# EAGLE board aleph-121205 (EAGLE 5.11), part 1 of 3
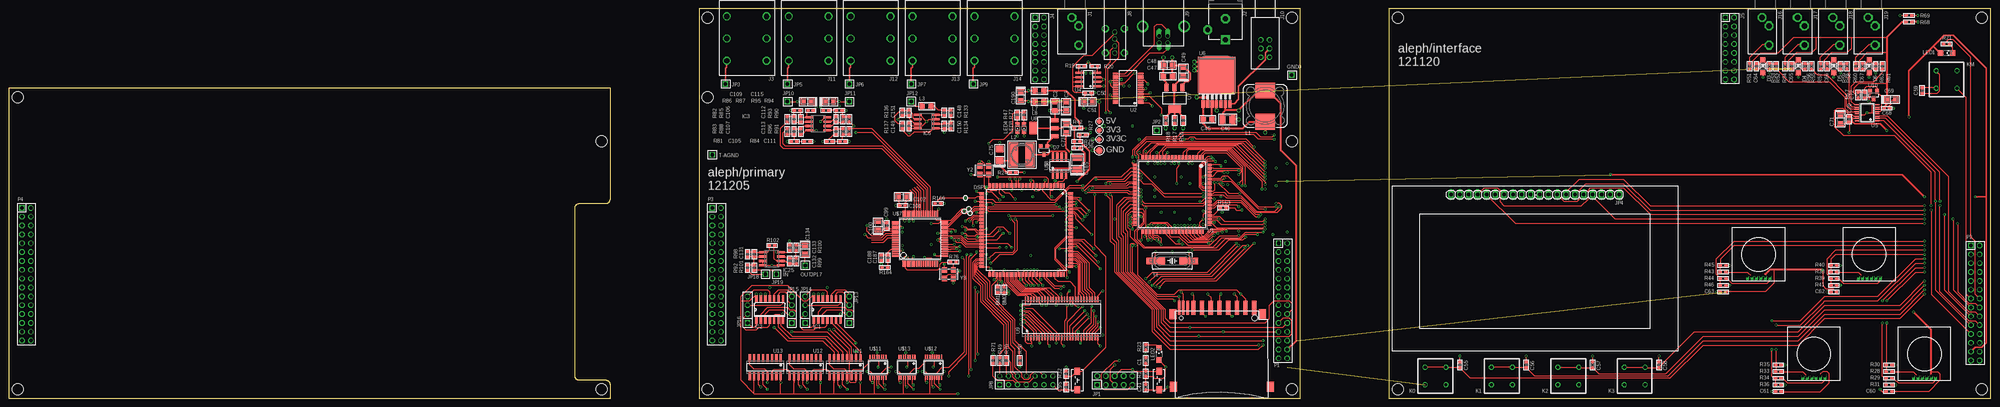
[diagram p8: board, top side]
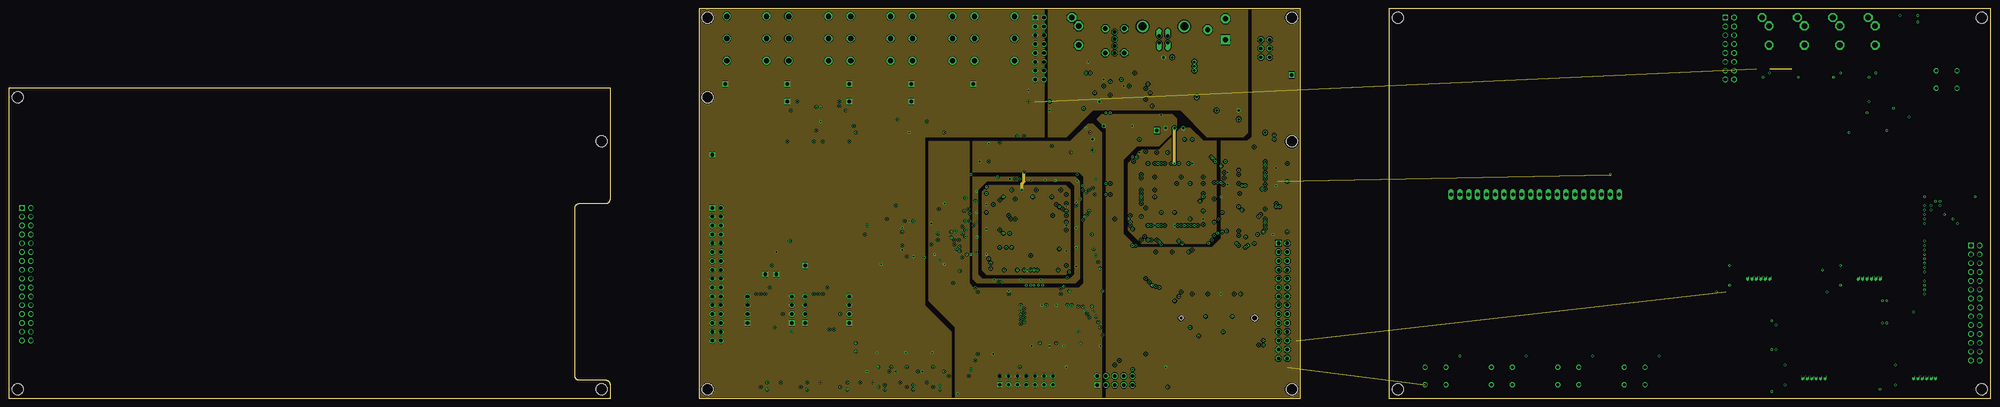
[diagram p9: board, inner layer Route2]
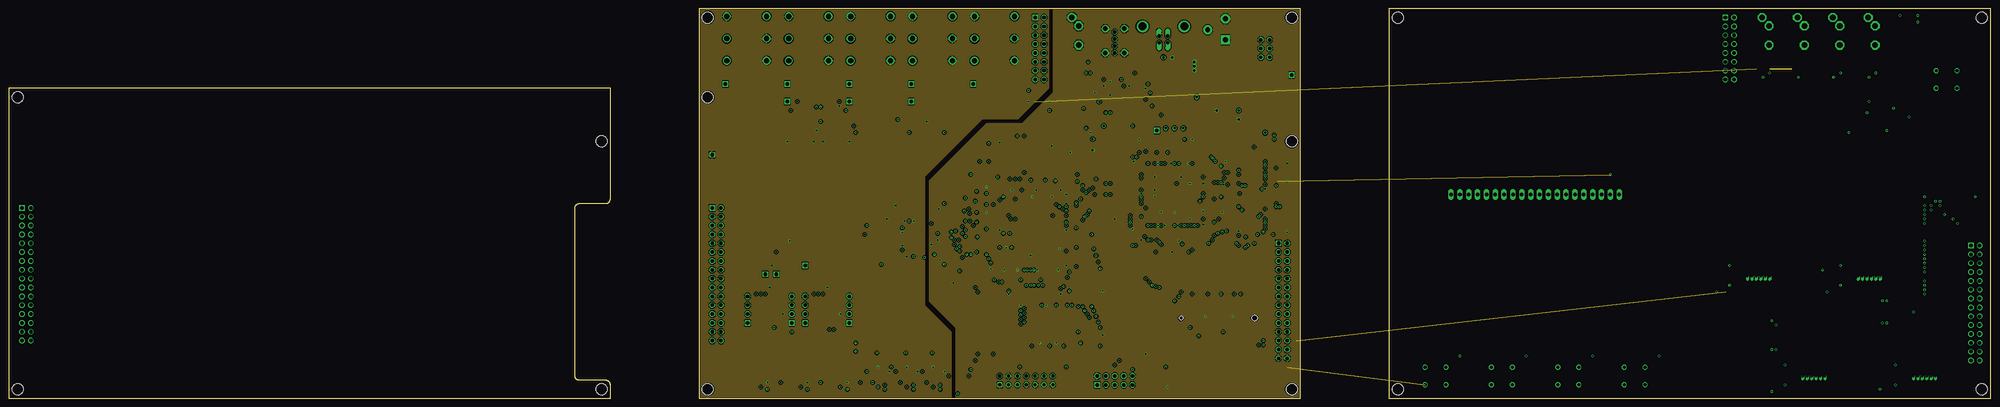
[diagram p10: board, inner layer Route3]
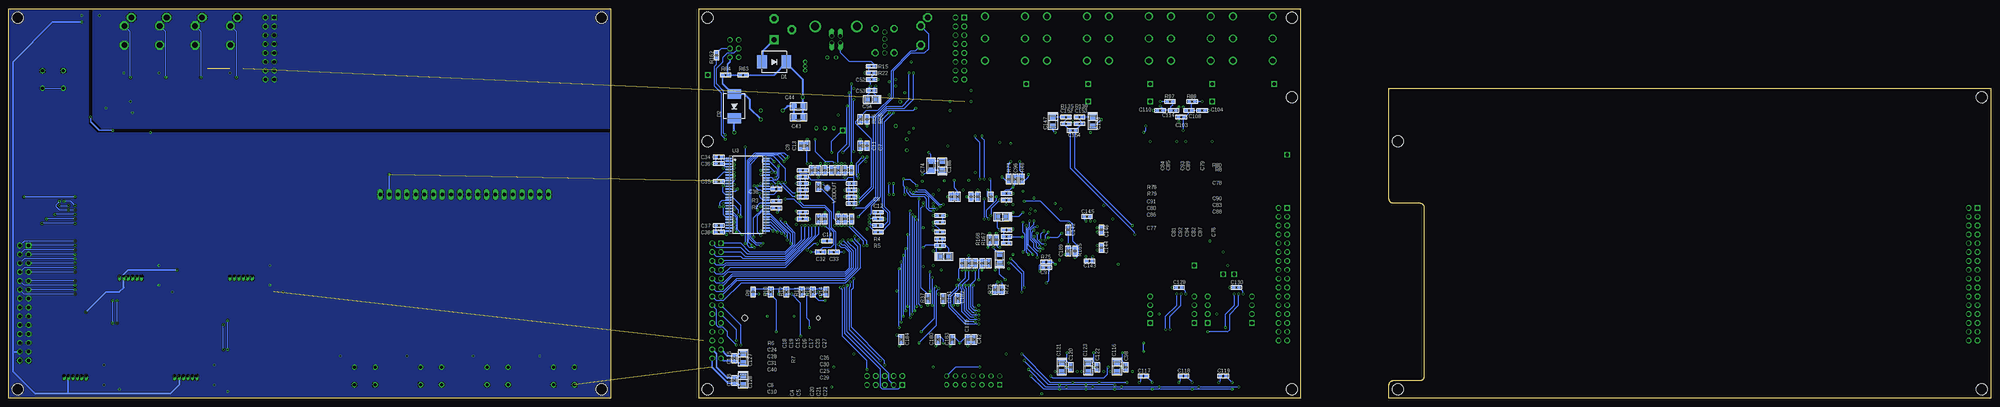
[diagram p11: board, bottom side, seen from below]

Size 568.96 x 111.76 mm. Coordinates in mm from the lower left corner, seen from the top.
Outline: 198.12,0 370.84,0 370.84,111.76 198.12,111.76 198.12,0
Outline: 396.24,0 568.96,0 568.96,111.76 396.24,111.76 396.24,0
Outline: 172.72,0 172.72,3.81 arc90 171.45,5.08 163.83,5.08 arc-90 162.56,6.35 162.56,54.61 arc-90 163.83,55.88 171.45,55.88 arc90 172.72,57.15 172.72,88.9 0,88.9 0,0 172.72,0
Copper layers (1*2+3*16): Top 0.035mm / dielectric 1.5mm / Route2 0.035mm / dielectric 0.15mm / Route3 0.035mm / dielectric 0.2mm / Bottom 0.035mm
Design rules "default *": minimum track width 6mil, minimum drill 15mil, track to track 6mil, track to pad 6mil, pad to pad 6mil, via to via 6mil, smd to smd 6mil, copper to edge 10mil, drill to drill 8mil, minimum pad ring 6mil, minimum via ring 6mil, stop-mask expansion 4mil, vias tented up to drill 0mil, thermal gap 10mil
Holes 3.2 mm at 368.3,109.22 200.66,109.22 200.66,2.54 368.3,2.54 170.18,2.54 170.18,73.66 2.54,86.36 2.54,2.54 200.66,86.36 368.3,73.66 398.78,2.54 398.78,109.22 566.42,109.22 566.42,2.54

## Footprints (pad centres in the part's own frame; a part is rotated, then mirrored left to right if it is on the bottom)
SMD-15R = smd 1.5 x 1.5: TP 0,0
R0603 = smd 0.9 x 0.8: 1 -0.762,0; 2 0.762,0
C0603 = smd 0.9 x 0.8: 1 -0.762,0; 2 0.762,0
C1206 = smd 1.4 x 1.8: 1 -1.27,0; 2 1.27,0
C1206/T = smd 1.4 x 1.9: + 1.27,0; - -1.27,0
C3225 = smd 1.6 x 2.7: 1 -1.397,0; 2 1.397,0
C3528/T = smd 2 x 2.2: + 1.651,0; - -1.651,0
C1210/T = smd 1.6 x 3: + 1.651,0; - -1.651,0
SMC = smd 2.8 x 3.8: A 3.493,0; C -3.493,0
SOD123 = smd 1.4 x 1.4: A 1.905,0; C -1.905,0
SOT23 = smd 1 x 1.4: 1 -0.95,-1.1; 2 0.95,-1.1; 3 0,1.1
LQFP176 = smd 1.5 x 0.25: P$1 -12.8,10.75; P$2 -12.8,10.25; P$3 -12.8,9.75; P$4 -12.8,9.25; P$5 -12.8,8.75; P$6 -12.8,8.25; P$7 -12.8,7.75; P$8 -12.8,7.25; P$9 -12.8,6.75; P$10 -12.8,6.25; P$11 -12.8,5.75; P$12 -12.8,5.25; P$13 -12.8,4.75; P$14 -12.8,4.25; P$15 -12.8,3.75; P$16 -12.8,3.25; P$17 -12.8,2.75; P$18 -12.8,2.25; P$19 -12.8,1.75; P$20 -12.8,1.25; P$21 -12.8,0.75; P$22 -12.8,0.25; P$23 -12.8,-0.25; P$24 -12.8,-0.75; P$25 -12.8,-1.25; P$26 -12.8,-1.75; P$27 -12.8,-2.25; P$28 -12.8,-2.75; P$29 -12.8,-3.25; P$30 -12.8,-3.75; P$31 -12.8,-4.25; P$32 -12.8,-4.75; P$33 -12.8,-5.25; P$34 -12.8,-5.75; P$35 -12.8,-6.25; P$36 -12.8,-6.75; P$37 -12.8,-7.25; P$38 -12.8,-7.75; P$39 -12.8,-8.25; P$40 -12.8,-8.75; P$41 -12.8,-9.25; P$42 -12.8,-9.75; P$43 -12.8,-10.25; P$44 -12.8,-10.75; P$89 12.8,-10.75; P$90 12.8,-10.25; P$91 12.8,-9.75; P$92 12.8,-9.25; P$93 12.8,-8.75; P$94 12.8,-8.25; P$95 12.8,-7.75; P$96 12.8,-7.25; P$97 12.8,-6.75; P$98 12.8,-6.25; P$99 12.8,-5.75; P$100 12.8,-5.25; P$101 12.8,-4.75; P$102 12.8,-4.25; P$103 12.8,-3.75; P$104 12.8,-3.25; P$105 12.8,-2.75; P$106 12.8,-2.25; P$107 12.8,-1.75; P$108 12.8,-1.25; P$109 12.8,-0.75; P$110 12.8,-0.25; P$111 12.8,0.25; P$112 12.8,0.75; P$113 12.8,1.25; P$114 12.8,1.75; P$115 12.8,2.25; P$116 12.8,2.75; P$117 12.8,3.25; P$118 12.8,3.75; P$119 12.8,4.25; P$120 12.8,4.75; P$121 12.8,5.25; P$122 12.8,5.75; P$123 12.8,6.25; P$124 12.8,6.75; P$125 12.8,7.25; P$126 12.8,7.75; P$127 12.8,8.25; P$128 12.8,8.75; P$129 12.8,9.25; P$130 12.8,9.75; P$131 12.8,10.25; P$132 12.8,10.75 | smd 0.25 x 1.5: P$45 -10.75,-12.8; P$46 -10.25,-12.8; P$47 -9.75,-12.8; P$48 -9.25,-12.8; P$49 -8.75,-12.8; P$50 -8.25,-12.8; P$51 -7.75,-12.8; P$52 -7.25,-12.8; P$53 -6.75,-12.8; P$54 -6.25,-12.8; P$55 -5.75,-12.8; P$56 -5.25,-12.8; P$57 -4.75,-12.8; P$58 -4.25,-12.8; P$59 -3.75,-12.8; P$60 -3.25,-12.8; P$61 -2.75,-12.8; P$62 -2.25,-12.8; P$63 -1.75,-12.8; P$64 -1.25,-12.8; P$65 -0.75,-12.8; P$66 -0.25,-12.8; P$67 0.25,-12.8; P$68 0.75,-12.8; P$69 1.25,-12.8; P$70 1.75,-12.8; P$71 2.25,-12.8; P$72 2.75,-12.8; P$73 3.25,-12.8; P$74 3.75,-12.8; P$75 4.25,-12.8; P$76 4.75,-12.8; P$77 5.25,-12.8; P$78 5.75,-12.8; P$79 6.25,-12.8; P$80 6.75,-12.8; P$81 7.25,-12.8; P$82 7.75,-12.8; P$83 8.25,-12.8; P$84 8.75,-12.8; P$85 9.25,-12.8; P$86 9.75,-12.8; P$87 10.25,-12.8; P$88 10.75,-12.8; P$133 10.75,12.8; P$134 10.25,12.8; P$135 9.75,12.8; P$136 9.25,12.8; P$137 8.75,12.8; P$138 8.25,12.8; P$139 7.75,12.8; P$140 7.25,12.8; P$141 6.75,12.8; P$142 6.25,12.8; P$143 5.75,12.8; P$144 5.25,12.8; P$145 4.75,12.8; P$146 4.25,12.8; P$147 3.75,12.8; P$148 3.25,12.8; P$149 2.75,12.8; P$150 2.25,12.8; P$151 1.75,12.8; P$152 1.25,12.8; P$153 0.75,12.8; P$154 0.25,12.8; P$155 -0.25,12.8; P$156 -0.75,12.8; P$157 -1.25,12.8; P$158 -1.75,12.8; P$159 -2.25,12.8; P$160 -2.75,12.8; P$161 -3.25,12.8; P$162 -3.75,12.8; P$163 -4.25,12.8; P$164 -4.75,12.8; P$165 -5.25,12.8; P$166 -5.75,12.8; P$167 -6.25,12.8; P$168 -6.75,12.8; P$169 -7.25,12.8; P$170 -7.75,12.8; P$171 -8.25,12.8; P$172 -8.75,12.8; P$173 -9.25,12.8; P$174 -9.75,12.8; P$175 -10.25,12.8; P$176 -10.75,12.8
SMD-20R = smd 2 x 2: TP 0,0
1X01 = drill 1.016 square: 1 0,0
SO14 = smd 0.66 x 2.032: 1 -3.81,-3.073; 2 -2.54,-3.073; 3 -1.27,-3.073; 4 0,-3.073; 5 1.27,-3.073; 6 2.54,-3.073; 7 3.81,-3.073; 8 3.81,3.073; 9 2.54,3.073; 10 1.27,3.073; 11 0,3.073; 12 -1.27,3.073; 13 -2.54,3.073; 14 -3.81,3.073
SO8 = smd 0.6 x 2.2: 1 -1.905,-2.6; 2 -0.635,-2.6; 3 0.635,-2.6; 4 1.905,-2.6; 5 1.905,2.6; 6 0.635,2.6; 7 -0.635,2.6; 8 -1.905,2.6
SO08 = smd 0.6 x 2.2: 1 -1.905,-2.6; 2 -0.635,-2.6; 3 0.635,-2.6; 4 1.905,-2.6; 5 1.905,2.6; 6 0.635,2.6; 7 -0.635,2.6; 8 -1.905,2.6
SJ1-3533NG = drill 1.6 pad 2.54 octagon: 1 0,-0.9; 2 2.4,1.1; 3 7.9,1.1
PJ-102XH = drill 1.422 pad 2.54 square: 1 0,0 | drill 1.422 pad 2.54 octagon: 2 0,-6.032; 3 5.08,-2.857
NEUTRIK-NRJ6HM-1 = drill 1.5 round: R 7.23,11.1; RN -4.2,11.1; S 7.23,4.75; SN -4.2,4.75; T 7.23,17.45; TN -4.2,17.45
DIL-100-2X08 = drill 1.016 square: 1 -8.89,-1.27 | drill 1.016 octagon: 2 -8.89,1.27; 3 -6.35,-1.27; 4 -6.35,1.27; 5 -3.81,-1.27; 6 -3.81,1.27; 7 -1.27,-1.27; 8 -1.27,1.27; 9 1.27,-1.27; 10 1.27,1.27; 11 3.81,-1.27; 12 3.81,1.27; 13 6.35,-1.27; 14 6.35,1.27; 15 8.89,-1.27; 16 8.89,1.27
USBA-VERT = drill 0.92 octagon: 1 0,-6; 2 0,-4; 3 0,-2; 4 0,0 | drill 1.35 octagon: G1 -2.72,0; G2 -2.72,-7; G3 2.72,-7; G4 2.72,0
USB_B = drill 0.95 offset: DM -1.25,4.71; DP -1.25,2.71; GND 1.25,2.71; VCC 1.25,4.71 | drill 2.3 round: MOUNT1 -6,0; MOUNT2 6,0
PHA2U = drill 1 octagon: 0 -1.25,0; 1 -1.25,-2.5; 2 -1.25,2.5; _0 1.25,0; _1 1.25,-2.5; _2 1.25,2.5
AVR-JTAG-10 = drill 1.016 square: 1 -5.08,-1.27 | drill 1.016 octagon: 2 -5.08,1.27; 3 -2.54,-1.27; 4 -2.54,1.27; 5 0,-1.27; 6 0,1.27; 7 2.54,-1.27; 8 2.54,1.27; 9 5.08,-1.27; 10 5.08,1.27
1X20 = drill 1.016 long: 1 -24.13,0; 2 -21.59,0; 3 -19.05,0; 4 -16.51,0; 5 -13.97,0; 6 -11.43,0; 7 -8.89,0; 8 -6.35,0; 9 -3.81,0; 10 -1.27,0; 11 1.27,0; 12 3.81,0; 13 6.35,0; 14 8.89,0; 15 11.43,0; 16 13.97,0; 17 16.51,0; 18 19.05,0; 19 21.59,0; 20 24.13,0
JPQ-07 = drill 0.914 square: 1 -7.62,-1.27 | drill 0.914 octagon: 2 -7.62,1.27; 3 -5.08,-1.27; 4 -5.08,1.27; 5 -2.54,-1.27; 6 -2.54,1.27; 7 0,-1.27; 8 0,1.27; 9 2.54,-1.27; 10 2.54,1.27; 11 5.08,-1.27; 12 5.08,1.27; 13 7.62,-1.27; 14 7.62,1.27
1X04 = drill 1.016 square: 1 -3.81,0 | drill 1.016 octagon: 2 -1.27,0; 3 1.27,0; 4 3.81,0
PVA1 = drill 0.9 octagon: 1 -3,-2.5; 2 -3,2.5; 3 3,2.5; 4 3,-2.5
MSS1278 = smd 5.5 x 4.5: 1 0,4.5; 2 0,-4.5
SRR6038 = smd 7.3 x 2.6: 1 0,2.35; 2 0,-2.35
L1206 = smd 1.4 x 1.8: 1 -1.27,0; 2 1.27,0
CHIPLED_1206 = smd 1.5 x 1.5: A 0,-1.75; C 0,1.75
CHIPLED_0805 = smd 1.2 x 1.2: A 0,-1.05; C 0,1.05
DIL-100-2X14 = drill 1.016 square: 1 -16.51,-1.27 | drill 1.016 octagon: 2 -16.51,1.27; 3 -13.97,-1.27; 4 -13.97,1.27; 5 -11.43,-1.27; 6 -11.43,1.27; 7 -8.89,-1.27; 8 -8.89,1.27; 9 -6.35,-1.27; 10 -6.35,1.27; 11 -3.81,-1.27; 12 -3.81,1.27; 13 -1.27,-1.27; 14 -1.27,1.27; 15 1.27,-1.27; 16 1.27,1.27; 17 3.81,-1.27; 18 3.81,1.27; 19 6.35,-1.27; 20 6.35,1.27; 21 8.89,-1.27; 22 8.89,1.27; 23 11.43,-1.27; 24 11.43,1.27; 25 13.97,-1.27; 26 13.97,1.27; 27 16.51,-1.27; 28 16.51,1.27
DIL-100-2X16 = drill 1.016 square: 1 -19.05,-1.27 | drill 1.016 octagon: 2 -19.05,1.27; 3 -16.51,-1.27; 4 -16.51,1.27; 5 -13.97,-1.27; 6 -13.97,1.27; 7 -11.43,-1.27; 8 -11.43,1.27; 9 -8.89,-1.27; 10 -8.89,1.27; 11 -6.35,-1.27; 12 -6.35,1.27; 13 -3.81,-1.27; 14 -3.81,1.27; 15 -1.27,-1.27; 16 -1.27,1.27; 17 1.27,-1.27; 18 1.27,1.27; 19 3.81,-1.27; 20 3.81,1.27; 21 6.35,-1.27; 22 6.35,1.27; 23 8.89,-1.27; 24 8.89,1.27; 25 11.43,-1.27; 26 11.43,1.27; 27 13.97,-1.27; 28 13.97,1.27; 29 16.51,-1.27; 30 16.51,1.27; 31 19.05,-1.27; 32 19.05,1.27
LQFP144 = smd 0.25 x 1.5: 1 -8.75,-10.6; 2 -8.25,-10.6; 3 -7.75,-10.6; 4 -7.25,-10.6; 5 -6.75,-10.6; 6 -6.25,-10.6; 7 -5.75,-10.6; 8 -5.25,-10.6; 9 -4.75,-10.6; 10 -4.25,-10.6; 11 -3.75,-10.6; 12 -3.25,-10.6; 13 -2.75,-10.6; 14 -2.25,-10.6; 15 -1.75,-10.6; 16 -1.25,-10.6; 17 -0.75,-10.6; 18 -0.25,-10.6; 19 0.25,-10.6; 20 0.75,-10.6; 21 1.25,-10.6; 22 1.75,-10.6; 23 2.25,-10.6; 24 2.75,-10.6; 25 3.25,-10.6; 26 3.75,-10.6; 27 4.25,-10.6; 28 4.75,-10.6; 29 5.25,-10.6; 30 5.75,-10.6; 31 6.25,-10.6; 32 6.75,-10.6; 33 7.25,-10.6; 34 7.75,-10.6; 35 8.25,-10.6; 36 8.75,-10.6; 73 8.75,10.6; 74 8.25,10.6; 75 7.75,10.6; 76 7.25,10.6; 77 6.75,10.6; 78 6.25,10.6; 79 5.75,10.6; 80 5.25,10.6; 81 4.75,10.6; 82 4.25,10.6; 83 3.75,10.6; 84 3.25,10.6; 85 2.75,10.6; 86 2.25,10.6; 87 1.75,10.6; 88 1.25,10.6; 89 0.75,10.6; 90 0.25,10.6; 91 -0.25,10.6; 92 -0.75,10.6; 93 -1.25,10.6; 94 -1.75,10.6; 95 -2.25,10.6; 96 -2.75,10.6; 97 -3.25,10.6; 98 -3.75,10.6; 99 -4.25,10.6; 100 -4.75,10.6; 101 -5.25,10.6; 102 -5.75,10.6; 103 -6.25,10.6; 104 -6.75,10.6; 105 -7.25,10.6; 106 -7.75,10.6; 107 -8.25,10.6; 108 -8.75,10.6 | smd 1.5 x 0.25: 37 10.6,-8.75; 38 10.6,-8.25; 39 10.6,-7.75; 40 10.6,-7.25; 41 10.6,-6.75; 42 10.6,-6.25; 43 10.6,-5.75; 44 10.6,-5.25; 45 10.6,-4.75; 46 10.6,-4.25; 47 10.6,-3.75; 48 10.6,-3.25; 49 10.6,-2.75; 50 10.6,-2.25; 51 10.6,-1.75; 52 10.6,-1.25; 53 10.6,-0.75; 54 10.6,-0.25; 55 10.6,0.25; 56 10.6,0.75; 57 10.6,1.25; 58 10.6,1.75; 59 10.6,2.25; 60 10.6,2.75; 61 10.6,3.25; 62 10.6,3.75; 63 10.6,4.25; 64 10.6,4.75; 65 10.6,5.25; 66 10.6,5.75; 67 10.6,6.25; 68 10.6,6.75; 69 10.6,7.25; 70 10.6,7.75; 71 10.6,8.25; 72 10.6,8.75; 109 -10.6,8.75; 110 -10.6,8.25; 111 -10.6,7.75; 112 -10.6,7.25; 113 -10.6,6.75; 114 -10.6,6.25; 115 -10.6,5.75; 116 -10.6,5.25; 117 -10.6,4.75; 118 -10.6,4.25; 119 -10.6,3.75; 120 -10.6,3.25; 121 -10.6,2.75; 122 -10.6,2.25; 123 -10.6,1.75; 124 -10.6,1.25; 125 -10.6,0.75; 126 -10.6,0.25; 127 -10.6,-0.25; 128 -10.6,-0.75; 129 -10.6,-1.25; 130 -10.6,-1.75; 131 -10.6,-2.25; 132 -10.6,-2.75; 133 -10.6,-3.25; 134 -10.6,-3.75; 135 -10.6,-4.25; 136 -10.6,-4.75; 137 -10.6,-5.25; 138 -10.6,-5.75; 139 -10.6,-6.25; 140 -10.6,-6.75; 141 -10.6,-7.25; 142 -10.6,-7.75; 143 -10.6,-8.25; 144 -10.6,-8.75
SSOP28 = smd 0.4 x 1.5: 1 -4.225,-3.625; 2 -3.575,-3.625; 3 -2.925,-3.625; 4 -2.275,-3.625; 5 -1.625,-3.625; 6 -0.975,-3.625; 7 -0.325,-3.625; 8 0.325,-3.625; 9 0.975,-3.625; 10 1.625,-3.625; 11 2.275,-3.625; 12 2.925,-3.625; 13 3.575,-3.625; 14 4.225,-3.625; 15 4.225,3.625; 16 3.575,3.625; 17 2.925,3.625; 18 2.275,3.625; 19 1.625,3.625; 20 0.975,3.625; 21 0.325,3.625; 22 -0.325,3.625; 23 -0.975,3.625; 24 -1.625,3.625; 25 -2.275,3.625; 26 -2.925,3.625; 27 -3.575,3.625; 28 -4.225,3.625
TSOP54 = smd 0.4 x 1.6: 1 -10.4,-5.45; 2 -9.6,-5.45; 3 -8.8,-5.45; 4 -8,-5.45; 5 -7.2,-5.45; 6 -6.4,-5.45; 7 -5.6,-5.45; 8 -4.8,-5.45; 9 -4,-5.45; 10 -3.2,-5.45; 11 -2.4,-5.45; 12 -1.6,-5.45; 13 -0.8,-5.45; 14 0,-5.45; 15 0.8,-5.45; 16 1.6,-5.45; 17 2.4,-5.45; 18 3.2,-5.45; 19 4,-5.45; 20 4.8,-5.45; 21 5.6,-5.45; 22 6.4,-5.45; 23 7.2,-5.45; 24 8,-5.45; 25 8.8,-5.45; 26 9.6,-5.45; 27 10.4,-5.45; 28 10.4,5.45; 29 9.6,5.45; 30 8.8,5.45; 31 8,5.45; 32 7.2,5.45; 33 6.4,5.45; 34 5.6,5.45; 35 4.8,5.45; 36 4,5.45; 37 3.2,5.45; 38 2.4,5.45; 39 1.6,5.45; 40 0.8,5.45; 41 0,5.45; 42 -0.8,5.45; 43 -1.6,5.45; 44 -2.4,5.45; 45 -3.2,5.45; 46 -4,5.45; 47 -4.8,5.45; 48 -5.6,5.45; 49 -6.4,5.45; 50 -7.2,5.45; 51 -8,5.45; 52 -8.8,5.45; 53 -9.6,5.45; 54 -10.4,5.45
TSSOP16 = smd 0.3 x 1.5: 1 -2.275,-2.8; 2 -1.625,-2.8; 3 -0.975,-2.8; 4 -0.325,-2.8; 5 0.325,-2.8; 6 0.975,-2.8; 7 1.625,-2.8; 8 2.275,-2.8; 9 2.275,2.8; 10 1.625,2.8; 11 0.975,2.8; 12 0.325,2.8; 13 -0.325,2.8; 14 -0.975,2.8; 15 -1.625,2.8; 16 -2.275,2.8
TO263-7 = smd 0.914 x 2.159: 1 -3.81,-5.715; 2 -2.54,-5.715; 3 -1.27,-5.715; 4 0,-5.715; 5 1.27,-5.715; 6 2.54,-5.715; 7 3.81,-5.715 | smd 10.8 x 10.41: 8 0,2.54
SOT223 = smd 1.219 x 2.235: 1 -2.311,-3.099; 2 0,-3.099; 3 2.311,-3.099 | smd 3.6 x 2.2: 4 0,3.099
SO16 = smd 0.6 x 2.2: 1 -4.445,-2.6; 2 -3.175,-2.6; 3 -1.905,-2.6; 4 -0.635,-2.6; 5 0.635,-2.6; 6 1.905,-2.6; 7 3.175,-2.6; 8 4.445,-2.6; 9 4.445,2.6; 10 3.175,2.6; 11 1.905,2.6; 12 0.635,2.6; 13 -0.635,2.6; 14 -1.905,2.6; 15 -3.175,2.6; 16 -4.445,2.6
PANASONIC-EVQ = smd 2 x 1.6: 1 2.7,0; 2 -2.7,0
BOURNS-EM14 = drill 0.6 pad 0.813 offset: P$1 -3.175,-6.35; P$2 -1.905,-6.35; P$3 -0.635,-6.35; P$4 0.635,-6.35; P$5 1.905,-6.35; P$6 3.175,-6.35
06132 = smd 1.2 x 4: 1 6.9,0.9; 2 4.4,0.9; 3 1.9,0.9; 4 -0.6,0.9; 5 -3.1,0.9; 6 -5.6,0.9; 7 -8.1,0.9; 9 9.4,0.9 | smd 0.7 x 4: 8 -9.7,0.9; CD -11,0.9; WP -12.2,0.9 | smd 2 x 2.8: GP -13.8,-21.8; GP2 14.1,-21.8; GP3 11.7,-0.9; GP4 -13.9,-1 | hole 1.1: -11.6,-2.1 | hole 1.6: 9.5,-2.1
SQFP-S-12X12-64 = smd 0.4 x 1.8: 1 -4.875,-7.1; 2 -4.225,-7.1; 3 -3.575,-7.1; 4 -2.925,-7.1; 5 -2.275,-7.1; 6 -1.625,-7.1; 7 -0.975,-7.1; 8 -0.325,-7.1; 9 0.325,-7.1; 10 0.975,-7.1; 11 1.625,-7.1; 12 2.275,-7.1; 13 2.925,-7.1; 14 3.575,-7.1; 15 4.225,-7.1; 16 4.875,-7.1; 33 4.875,7.1; 34 4.225,7.1; 35 3.575,7.1; 36 2.925,7.1; 37 2.275,7.1; 38 1.625,7.1; 39 0.975,7.1; 40 0.325,7.1; 41 -0.325,7.1; 42 -0.975,7.1; 43 -1.625,7.1; 44 -2.275,7.1; 45 -2.925,7.1; 46 -3.575,7.1; 47 -4.225,7.1; 48 -4.875,7.1 | smd 1.8 x 0.4: 17 7.1,-4.875; 18 7.1,-4.225; 19 7.1,-3.575; 20 7.1,-2.925; 21 7.1,-2.275; 22 7.1,-1.625; 23 7.1,-0.975; 24 7.1,-0.325; 25 7.1,0.325; 26 7.1,0.975; 27 7.1,1.625; 28 7.1,2.275; 29 7.1,2.925; 30 7.1,3.575; 31 7.1,4.225; 32 7.1,4.875; 49 -7.1,4.875; 50 -7.1,4.225; 51 -7.1,3.575; 52 -7.1,2.925; 53 -7.1,2.275; 54 -7.1,1.625; 55 -7.1,0.975; 56 -7.1,0.325; 57 -7.1,-0.325; 58 -7.1,-0.975; 59 -7.1,-1.625; 60 -7.1,-2.275; 61 -7.1,-2.925; 62 -7.1,-3.575; 63 -7.1,-4.225; 64 -7.1,-4.875
SMD-15RN = smd 1.5 x 1.5: TP 0,0
HC49UP = smd 5.334 x 1.93: 1 -4.763,0; 2 4.763,0
ASFL1 = smd 1.7 x 1.5: 1 -1.27,-1.2; 2 1.27,-1.2; 3 1.27,1.2; 4 -1.27,1.2

## Placement (x,y rotation side)
3V3  TPS-SMD-15R  [SMD-15R]  313.06,76.83 0 top
3V3C  TPS-SMD-15R  [SMD-15R]  313.06,74.3 0 top
5V  TPS-SMD-15R  [SMD-15R]  313.06,79.38 0 top
BM0  0  [R0603]  285.75,31.11 90 top
BM1  DNP  [R0603]  283.85,31.11 90 top
C1  100n  [C0603]  326.39,10.79 90 top
C2  100n  [C1206]  300.36,83.82 270 top
C3  10u  [C1206/T]  303.53,83.82 270 top
C4  100n  [C0603]  336.55,51.44 90 bottom
C5  33n  [C0603]  334.64,51.44 90 bottom
C6  100n  [C0603]  341,53.34 0 bottom
C7  100n  [C0603]  322.58,72.39 90 bottom
C8  100n  [C0603]  319.4,53.34 0 bottom
C9  100n  [C0603]  341.63,72.39 90 bottom
C10  33n  [C0603]  341,51.44 0 bottom
C11  33n  [C0603]  324.49,72.39 90 bottom
C12  33n  [C0603]  319.4,51.44 0 bottom
C13  33n  [C0603]  339.73,72.39 90 bottom
C14  4.7u  [C0603]  334.01,45.09 180 bottom
C15  33n  [C0603]  334.64,65.41 270 bottom
C16  100n  [C0603]  332.74,65.41 270 bottom
C17  4.7u  [C0603]  330.84,65.41 270 bottom
C18  2.2u  [C0603]  338.46,65.41 270 bottom
C19  470p  [C0603]  336.55,65.41 270 bottom
C20  2.7n  [C0603]  330.84,51.44 90 bottom
C21  33n  [C0603]  328.93,51.44 90 bottom
C22  2.2u  [C0603]  327.02,51.44 90 bottom
C23  2.7n  [C0603]  328.93,65.41 270 bottom
C24  2.7n  [C0603]  341,63.5 0 bottom
C25  2.7n  [C0603]  327.02,57.78 180 bottom
C26  2.7n  [C0603]  327.02,61.59 180 bottom
C27  33n  [C0603]  327.02,65.41 270 bottom
C28  33n  [C0603]  341,61.59 0 bottom
C29  33n  [C0603]  327.02,55.88 180 bottom
C30  33n  [C0603]  327.02,59.69 180 bottom
C31  100n  [C0603]  341,59.69 0 bottom
C32  22p  [C0603]  335.91,41.91 0 bottom
C33  22p  [C0603]  332.11,41.91 180 bottom
C34  4.7u  [C0603]  365.12,69.22 180 bottom
C35  100n  [C0603]  365.12,62.23 180 bottom
C36  33n  [C0603]  365.12,67.31 180 bottom
C37  100n  [C0603]  365.12,49.53 180 bottom
C38  33n  [C0603]  348.62,60.01 0 bottom
C39  4.7u  [C0603]  365.12,47.62 180 bottom
C40  2.2u  [C0603]  341,57.78 0 bottom
C41  100n  [C0603]  326.39,3.17 270 top
C42  10n  [C0603]  291.78,16.83 270 bottom
C43  22u  [C1206]  342.26,80.64 0 bottom
C44  470n  [C1206]  342.26,83.82 0 bottom
C45  10n  [C1206]  344.17,80.01 0 top
C46  47u  [C3225]  349.88,80.01 0 top
C47  100n  [C1206]  332.74,92.39 180 top
C48  10u  [C1206/T]  332.74,95.57 180 top
C49  10u  [C1206/T]  337.19,93.66 270 top
C50  100n  [C0603]  309.88,87.63 180 top
C51  4.7u  [C1206/T]  309.88,85.09 180 top
C52  100n  [C0603]  321.31,91.44 0 bottom
C53  100n  [C0603]  321.31,88.27 0 bottom
C54  4.7u  [C1206/T]  321.31,85.72 0 bottom
C55  100n  [C0603]  416.56,9.53 270 top
C56  100n  [C0603]  435.61,9.53 270 top
C57  100n  [C0603]  454.66,9.53 270 top
C58  100n  [C0603]  473.71,9.53 270 top
C59  100n  [C0603]  549.27,88.27 90 top
C60  100n  [C0603]  539.75,1.91 0 top
C61  100n  [C0603]  508,1.91 0 top
C62  100n  [C0603]  523.88,30.48 0 top
C63  100n  [C0603]  492.12,30.48 0 top
C64  10n  [C0603]  501.65,95.25 270 top
C65  10n  [C0603]  511.81,95.25 270 top
C66  10n  [C0603]  521.97,95.25 270 top
C67  10n  [C0603]  532.13,95.25 270 top
C68  100n  [C0603]  539.12,83.19 180 top
C69  10u  [C1206/T]  540.38,85.72 180 top
C70  100n  [C0603]  528.32,80.01 90 top
C71  10u  [C1206/T]  525.78,80.01 90 top
C72  100n  [C0603]  532.76,87 90 top
C73  10u  [C1206/T]  303.53,77.47 90 top
C74  100n  [C1206]  304.17,66.67 270 bottom
C75  100u  [C3528/T]  284.48,69.85 270 top
C76  10u  [C1206/T]  284.48,40.01 270 bottom
C77  10u  [C1206/T]  300.36,40.64 180 bottom
C78  10u  [C1206/T]  283.85,52.07 0 bottom
C79  100n  [C0603]  287.02,57.78 90 bottom
C80  100n  [C0603]  301.62,45.72 180 bottom
C81  100n  [C0603]  295.27,38.73 270 bottom
C82  100n  [C0603]  289.56,38.73 270 bottom
C83  100n  [C0603]  282.57,46.35 0 bottom
C84  100n  [C0603]  298.45,57.78 90 bottom
C85  10n  [C0603]  296.55,57.78 90 bottom
C86  10n  [C0603]  301.62,43.81 180 bottom
C87  10n  [C0603]  287.65,38.73 270 bottom
C88  10n  [C0603]  282.57,44.45 0 bottom
C89  100n  [C0603]  290.83,57.78 90 bottom
C90  100n  [C0603]  282.57,48.26 0 bottom
C91  100n  [C0603]  301.62,47.62 0 bottom
C92  100n  [C0603]  293.37,38.73 270 bottom
C93  10n  [C0603]  292.74,57.78 90 bottom
C94  10n  [C0603]  291.47,38.73 270 bottom
C95  100n  [C0603]  303.53,3.17 270 top
C96  10n  [C0603]  280.04,62.87 270 bottom
C97  10n  [C0603]  271.14,37.47 0 bottom
C98  100n  [C0603]  248.28,8.89 270 bottom
C99  100n  [C0603]  252.09,49.53 270 top
C100  47u  [C1206/T]  249.56,49.53 270 top
C101  100n  [C0603]  256.54,55.24 0 top
C102  10u  [C1206/T]  256.54,57.78 0 top
C103  100n  [C0603]  232.41,80.64 180 bottom
C104  270p  [C0603]  226.38,82.55 0 bottom
C105  560p  [C0603]  229.24,73.66 0 top
C106  68p  [C0603]  227.33,80.01 90 top
C107  220p  [C0603]  227.33,76.52 90 top
C108  2200p  [C0603]  230.19,82.55 180 bottom
C109  10u  [C1206/T]  229.24,85.09 0 top
C110  270p  [C0603]  238.44,82.55 180 bottom
C111  560p  [C0603]  239.4,73.66 0 top
C112  68p  [C0603]  237.49,80.01 90 top
C113  220p  [C0603]  237.49,76.52 90 top
C114  2200p  [C0603]  234.63,82.55 0 bottom
C115  10u  [C1206/T]  235.59,85.09 180 top
C116  10u  [C1206/T]  250.82,8.89 90 bottom
C117  100n  [C0603]  243.21,6.35 0 bottom
C118  100n  [C0603]  231.78,6.35 0 bottom
C119  100n  [C0603]  220.34,6.35 0 bottom
C120  100n  [C0603]  264.16,8.89 270 bottom
C121  10u  [C1206/T]  266.7,8.89 90 bottom
C122  100n  [C0603]  256.54,8.89 270 bottom
C123  10u  [C1206/T]  259.08,8.89 90 bottom
C124  4.7u  [C1206/T]  257.81,79.38 90 bottom
C125  100n  [C0603]  360.68,11.43 90 bottom
C126  100n  [C0603]  360.68,5.08 90 bottom
C127  10u  [C1206/T]  358.14,11.43 90 bottom
C128  10u  [C1206/T]  358.14,5.08 90 bottom
C129  100n  [C0603]  233.05,31.75 180 bottom
C130  100n  [C0603]  216.53,31.75 180 bottom
C131  27p  [C0603]  214,41.27 90 top
C132  47p  [C0603]  224.16,39.37 90 top
C133  100n  [C0603]  224.16,43.18 90 top
C134  10u  [C1206/T]  228.6,42.55 90 top
C142  100n  [C0603]  264.8,48.26 270 bottom
C143  100n  [C0603]  258.76,39.37 0 bottom
C144  100n  [C0603]  255.27,43.18 90 bottom
C145  100n  [C0603]  259.4,52.07 180 bottom
C146  100n  [C0603]  255.27,48.26 270 bottom
C147  4.7u  [C1206/T]  269.24,79.38 90 bottom
C148  100p  [C0603]  268.61,81.92 90 top
C149  100n  [C0603]  258.44,78.11 270 top
C150  120p  [C0603]  268.61,78.11 90 top
C151  120p  [C0603]  258.44,81.92 90 top
C152  1n  [C0603]  265.43,78.74 0 bottom
C153  1n  [C0603]  261.62,78.74 0 bottom
C154  100p  [C0603]  263.52,76.83 0 bottom
C179  10n  [C0603]  293.69,16.83 270 bottom
C180  10n  [C0603]  302.26,16.83 270 bottom
C181  10n  [C0603]  300.67,28.57 270 bottom
C182  10n  [C0603]  296.55,28.57 270 bottom
C183  10n  [C0603]  298.13,16.83 270 bottom
C184  10n  [C0603]  312.74,16.83 270 bottom
C185  100u  [C1210/T]  306.7,67.31 270 top
C186  10u  [C1206/T]  300.99,66.67 270 bottom
C187  5600p  [C0603]  252.41,40.32 90 top
C188  390p  [C0603]  250.51,40.32 90 top
C189  100n  [C0603]  264.8,42.23 90 bottom
C190  10u  [C1206/T]  290.51,86.68 90 top
D1  MBRS360T3  [SMC]  349.25,96.52 180 bottom
D2  MBRS360T3  [SMC]  360.68,83.82 90 bottom
D3  1N4148W-7  [SOD123]  503.56,95.25 270 top
D4  1N4148W-7  [SOD123]  513.72,95.25 270 top
D5  1N4148W-7  [SOD123]  523.88,95.25 270 top
D6  1N4148W-7  [SOD123]  534.04,95.25 270 top
D7  zhcs1000  [SOT23]  297.18,71.12 180 top
DSP1  BF533  [LQFP176]  292.1,48.26 270 top
GND  TPS-SMD-20R  [SMD-20R]  313.06,71.12 0 top
GND0  [1X01]  368.3,92.71 0 top
IC1  4066D  [SO14]  234.95,25.4 0 top
IC2  4066D  [SO14]  218.44,25.4 0 top
IC3  AD8606  [SO8]  232.41,78.74 270 top
IC6  AD8606  [SO8]  263.52,79.38 90 top
IC25  TL072D  [SO08]  219.07,40.01 270 top
J1  SJ1-3533NG  [SJ1-3533NG]  306.07,109.22 270 top
J2  PJ-102AH/BH  [PJ-102XH]  349.25,102.87 180 top
J3  STEREOSW2GND  [NEUTRIK-NRJ6HM-1]  213.36,114.3 180 top
J4  F-2X08-DIL-100  [DIL-100-2X08]  295.91,100.33 270 top
J5  F-2X08-DIL-100  [DIL-100-2X08]  494.03,100.33 270 top
J8  USBA-VERT  [USBA-VERT]  317.5,99.06 180 top
J9  [USB_B]  331.47,106.68 180 top
J10  PHA2U  [PHA2U]  360.68,100.33 180 top
J11  STEREOSW2GND  [NEUTRIK-NRJ6HM-1]  231.14,114.3 180 top
J12  STEREOSW2GND  [NEUTRIK-NRJ6HM-1]  248.92,114.3 180 top
J13  STEREOSW2GND  [NEUTRIK-NRJ6HM-1]  266.7,114.3 180 top
J14  STEREOSW2GND  [NEUTRIK-NRJ6HM-1]  284.48,114.3 180 top
J16  SJ1-3533NG  [SJ1-3533NG]  504.19,109.22 270 top
J17  SJ1-3533NG  [SJ1-3533NG]  514.35,109.22 270 top
J18  SJ1-3533NG  [SJ1-3533NG]  524.51,109.22 270 top
J19  SJ1-3533NG  [SJ1-3533NG]  534.67,109.22 270 top
JP1  AVR-JTAG  [AVR-JTAG-10]  317.5,5.08 0 top
JP2  [1X01]  329.56,76.83 0 top
JP3  [1X01]  205.74,90.17 0 top
JP4  OLED  [1X20]  438.15,58.42 180 top
JP5  [1X01]  223.52,90.17 0 top
JP6  [1X01]  241.3,90.17 0 top
JP7  [1X01]  259.08,90.17 0 top
JP8  JPQ-07-100  [JPQ-07]  292.1,5.08 0 top
JP9  [1X01]  276.86,90.17 0 top
JP10  [1X01]  223.52,85.09 0 top
JP11  [1X01]  241.3,85.09 0 top
JP12  [1X01]  259.08,85.09 270 top
JP13  [1X04]  241.3,25.4 90 top
JP14  [1X04]  228.6,25.4 90 top
JP15  [1X04]  224.79,25.4 90 top
JP16  [1X04]  212.09,25.4 90 top
JP17  [1X01]  228.6,38.1 0 top
JP18  [1X01]  217.17,35.56 0 top
JP19  [1X01]  220.34,35.56 0 top
K0  PVA1  [PVA1]  409.58,6.35 180 top
K1  PVA1  [PVA1]  428.62,6.35 180 top
K2  PVA1  [PVA1]  447.68,6.35 180 top
K3  PVA1  [PVA1]  466.73,6.35 180 top
KM  PVA1  [PVA1]  556.26,91.44 0 top
L1  MSS1278  [MSS1278]  360.68,83.82 180 top
L2  SRR6038-100Y  [SRR6038]  290.83,69.85 270 top
L3  600  [L1206]  263.52,83.82 180 top
L7  600  [L1206]  295.91,88.27 0 top
L8  600  [L1206]  295.91,85.09 0 top
LED1  [CHIPLED_1206]  556.26,99.06 270 top
LED2  [CHIPLED_1206]  330.2,12.7 0 top
LED3  [CHIPLED_0805]  291.47,77.47 180 top
LED4  [CHIPLED_0805]  289.56,77.47 180 top
P1  M-2X14-DIL-100  [DIL-100-2X14]  365.76,27.94 270 top
P2  M-2X14-DIL-100  [DIL-100-2X14]  564.51,27.3 270 top
P3  M-2X16-DIL-100  [DIL-100-2X16]  203.2,35.56 270 top
P4  M-2X16-DIL-100  [DIL-100-2X16]  5.08,35.56 270 top
R1  10k  [R0603]  326.39,6.99 270 top
R2  4.7k  [R0603]  348.62,54.61 0 bottom
R3  4.7k  [R0603]  348.62,56.52 0 bottom
R4  39  [R0603]  319.4,49.53 0 bottom
R5  39  [R0603]  319.4,47.62 0 bottom
R6  0  [R0603]  341,65.41 180 bottom
R7  0  [R0603]  336.55,60.64 270 bottom
R8  100k  [R0603]  282.57,56.83 180 bottom
R9  100k  [R0603]  355.28,30.48 90 bottom
R10  100k  [R0603]  350.2,30.48 90 bottom
R11  100k  [R0603]  341.31,30.48 90 bottom
R12  100k  [R0603]  345.76,30.48 90 bottom
R13  100k  [R0603]  338.14,30.48 90 bottom
R14  100k  [R0603]  334.33,30.48 90 bottom
R15  4.7k  [R0603]  321.31,95.25 0 bottom
R16  0  [R0603]  337.19,79.69 90 top
R17  0  [R0603]  334.64,79.69 90 top
R18  0  [R0603]  332.11,79.69 90 top
R19  47k  [R0603]  307.98,95.25 0 top
R20  47k  [R0603]  311.79,95.25 180 top
R21  150  [R0603]  556.26,101.6 0 top
R22  10k  [R0603]  321.31,93.34 0 bottom
R23  150  [R0603]  326.39,14.61 90 top
R24  0  [R0603]  288.29,64.77 180 top
R25  0  [R0603]  306.7,73.66 180 top
R26  0  [R0603]  306.7,71.75 180 top
R27  3.32k  [R0603]  308.29,75.56 0 top
R28  470  [R0603]  539.75,7.62 180 top
R29  470  [R0603]  539.75,5.71 180 top
R30  910  [R0603]  539.75,9.53 180 top
R31  910  [R0603]  539.75,3.81 180 top
R32  10k  [R0603]  303.53,6.99 90 top
R33  470  [R0603]  508,7.62 180 top
R34  470  [R0603]  508,5.71 180 top
R35  910  [R0603]  508,9.53 180 top
R36  910  [R0603]  508,3.81 180 top
R37  22  [R0603]  305.12,28.57 90 bottom
R38  470  [R0603]  523.88,36.2 180 top
R39  470  [R0603]  523.88,34.29 180 top
R40  910  [R0603]  523.88,38.1 180 top
R41  910  [R0603]  523.88,32.38 180 top
R42  0  [R0603]  306.7,77.47 180 top
R43  470  [R0603]  492.12,36.2 180 top
R44  470  [R0603]  492.12,34.29 180 top
R45  910  [R0603]  492.12,38.1 180 top
R46  910  [R0603]  492.12,32.38 180 top
R47  150  [R0603]  289.56,81.28 90 top
R48  10k  [R0603]  278.13,62.87 90 bottom
R49  0  [R0603]  284.48,10.79 270 top
R50  0  [R0603]  290.19,10.79 270 top
R51  10k  [R0603]  499.75,95.25 270 top
R52  10k  [R0603]  507.37,95.25 90 top
R53  10k  [R0603]  505.46,95.25 270 top
R54  10k  [R0603]  509.91,95.25 270 top
R55  10k  [R0603]  517.52,95.25 90 top
R56  10k  [R0603]  515.62,95.25 270 top
R57  10k  [R0603]  520.07,95.25 270 top
R58  10k  [R0603]  527.68,95.25 90 top
R59  10k  [R0603]  525.78,95.25 270 top
R60  10k  [R0603]  530.23,95.25 270 top
R61  10k  [R0603]  537.85,95.25 90 top
R62  10k  [R0603]  535.94,95.25 270 top
R63  330k  [R0603]  358.14,92.71 0 bottom
R64  100k  [R0603]  363.22,92.71 180 bottom
R65  10k  [R0603]  322.58,80.01 90 bottom
R66  10k  [R0603]  324.49,80.01 90 bottom
R67  1k  [R0603]  530.86,87 90 top
R68  0  [R0603]  545.47,107.95 0 top
R69  0  [R0603]  545.47,109.86 0 top
R70  4k7  [R0603]  286.38,10.79 270 top
R71  4k7  [R0603]  282.57,10.79 270 top
R72  10k  [R0603]  283.85,31.11 270 bottom
R73  10k  [R0603]  285.75,31.11 270 bottom
R74  33  [R0603]  281.94,62.87 90 bottom
R75  10k  [R0603]  271.14,39.05 0 bottom
R76  33  [R0603]  271.14,39.05 0 top
R77  150  [R0603]  291.47,81.28 90 top
R78  10k  [R0603]  301.62,52.39 0 bottom
R79  10k  [R0603]  301.62,50.48 0 bottom
R80  10k  [R0603]  282.57,58.74 0 bottom
R81  5K62  [R0603]  225.43,73.66 180 top
R82  11k  [R0603]  223.52,80.01 270 top
R83  5K62  [R0603]  223.52,76.52 90 top
R84  5K62  [R0603]  235.59,73.66 180 top
R85  3K01  [R0603]  225.43,80.01 90 top
R86  11k  [R0603]  226.38,82.55 180 top
R87  604  [R0603]  230.19,82.55 0 top
R88  1K5  [R0603]  225.43,76.52 90 top
R89  49k9  [R0603]  229.24,85.09 180 bottom
R90  11k  [R0603]  241.3,80.01 270 top
R91  5K62  [R0603]  241.3,76.52 90 top
R92  10k  [R0603]  212.09,37.47 270 top
R93  3k01  [R0603]  239.4,80.01 90 top
R94  11k  [R0603]  238.44,82.55 0 top
R95  604  [R0603]  234.63,82.55 180 top
R96  1k65  [R0603]  239.4,76.52 90 top
R97  49k9  [R0603]  235.59,85.09 0 bottom
R98  10k  [R0603]  212.09,41.27 270 top
R99  10k  [R0603]  226.06,39.37 270 top
R100  100  [R0603]  226.06,43.18 270 top
R101  10k  [R0603]  214,37.47 270 top
R102  10k  [R0603]  219.07,43.81 180 top
R133  5k76  [R0603]  270.51,81.92 90 top
R134  5k76  [R0603]  270.51,78.11 90 top
R135  237  [R0603]  265.43,80.64 180 bottom
R136  5k76  [R0603]  256.54,81.92 90 top
R137  5k76  [R0603]  256.54,78.11 270 top
R139  237  [R0603]  261.62,80.64 0 bottom
R162  100k  [R0603]  365.76,98.42 270 bottom
R163  22  [R0603]  348.62,54.61 180 top
R164  562  [R0603]  251.46,37.47 180 top
R165  10k  [R0603]  262.89,42.23 90 bottom
R166  100k  [R0603]  266.7,55.88 180 top
R167  0  [R0603]  285.43,45.4 90 bottom
R168  0  [R0603]  287.34,45.4 90 bottom
T-AGND  [1X01]  201.93,69.85 0 top
U1  AT32UC3A0512  [LQFP144]  334.01,58.42 180 top
U2  FT232RL  [SSOP28]  321.31,88.9 90 top
U3  MT48LC16M16A2  [TSOP54]  356.87,58.42 270 bottom
U4  TPS2020  [SO08]  309.88,91.44 90 top
U5  AD7923  [TSSOP16]  533.4,81.92 90 top
U6  LM2678  [TO263-7]  346.71,90.17 0 top
U7  ADP3339  [SOT223]  334.64,86.04 180 top
U8  ADP3339  [SOT223]  297.18,77.47 90 top
U9  MT48LC32M16A2tg-75  [TSOP54]  302.26,22.86 0 top
U10  LM4040M3  [SOT23]  535.31,87 180 top
U11  74LS595D  [SO16]  240.03,8.89 180 top
U12  74LS595D  [SO16]  228.6,8.89 180 top
U13  74LS595D  [SO16]  217.17,8.89 180 top
U$1  PANASONIC-EVQ  [PANASONIC-EVQ]  330.2,5.08 270 top
U$2  BOURNS-EM14  [BOURNS-EM14]  549.91,12.7 0 top
U$3  BOURNS-EM14  [BOURNS-EM14]  518.16,12.7 0 top
U$4  BOURNS-EM14  [BOURNS-EM14]  534.04,41.28 0 top
U$5  BOURNS-EM14  [BOURNS-EM14]  502.29,41.27 0 top
U$6  SDMMC06132  [06132]  348.14,25.08 0 top
U$7  AD1939  [SQFP-S-12X12-64]  261.62,45.72 0 top
U$8  FDS9431A  [SO08]  301.62,66.67 0 top
U$9  PANASONIC-EVQ  [PANASONIC-EVQ]  306.7,5.08 270 top
U$10  NHD-2.7  [NHD-2.7]  438.15,58.42 0 top
U$11  AD5317R  [TSSOP16]  249.56,8.89 180 top
U$12  AD5686R  [TSSOP16]  265.43,8.89 180 top
U$13  AD5317R  [TSSOP16]  257.81,8.89 180 top
VDDOUT  TPS-SMD-15RN  [SMD-15RN]  334.01,60.33 180 bottom
Y1  12mhz  [HC49UP]  334.01,39.37 0 top
Y2  ASFL1-27mhz  [ASFL1]  280.04,65.41 0 top
Y3  ASFL1-12.288mhz  [ASFL1]  269.88,35.56 0 top

## Tracks (layer width: path | path; a pad name or v marks a point on that pad's centre or on a via)
+3V3  (via drill 0.38, 0.6, 0.7)  (1 unrouted)
  Top 0.152: C41.1 R1.2 328.42,6.22 328.93,5.71 331.47,5.71 332.11,6.35 v332.11,8.89 | 332.11,9.04 LED2.A | U$6.4 347.54,29.4 v347.98,29.84
  Top 0.254: U2.4 327.39,86.62 330.84,83.19 v330.84,81.28 | U5.15 529.31,80.29 529.27,80.25 | 528.45,80.64 C70.2 | 554.36,99.06 LED1.A | 3V3.TP v314.32,78.11
  Top 0.406: 529.31,80.29 528.95,80.64 528.45,80.64 | C70.2 527.56,80.77 527.05,81.28 C71.+ | v332.11,8.89 332.11,9.04 | P2.25 564.51,14.61 566.42,14.61 567.69,15.88 567.69,57.78 | 567.69,57.78 567.69,94.61 558.16,104.14 555.62,104.14 552.45,100.97 | 552.45,100.97 554.36,99.06 | 552.45,100.97 545.47,93.98 v545.47,80.64 | v539.12,76.83 537.21,78.74 529.91,78.74 529.27,79.38 529.27,80.25 | v459.74,64.14 543.56,64.14 v549.91,57.78 | v564.51,57.78 567.69,57.78
  Top 0.61: v332.11,77.47 R18.1
  Bottom 0.152: R3.2 347.98,56.52 v347.98,57.78 | R14.2 R13.2 R11.2 R12.2 347.98,31.24 | 347.98,31.24 R10.2 R9.2 | 347.98,31.24 v347.98,29.84
  Bottom 0.203: U3.27 363.14,48.02 363.54,47.62 | 363.54,47.62 C39.1 C37.1 | 363.54,47.62 v362.9,46.99 | 363.54,67.22 364.27,67.22 C36.1 C34.1 | U3.3 363.54,67.22 | U3.1 363.3,68.82 363.54,68.58 363.54,67.22 | 363.54,67.22 363.54,66.36 v363.86,66.04 | U3.9 363.35,62.42 363.54,62.23 | 363.54,62.23 363.54,61.28 v363.86,60.96 363.86,59.05 363.22,58.42 U3.14 | 363.54,62.23 C35.1 | U3.49 349.94,64.82 v349.88,64.77 | C38.1 U3.43 | C38.1 | C38.1 349.39,60.78 v349.88,61.28 | v322.58,78.11 R65.1 R66.1
  Bottom 0.406: v545.47,80.64 545.47,79.38 542.92,76.83 v539.12,76.83 | JP4.2 v459.74,64.14 | v549.91,57.78 v564.51,57.78 | P1.25 362.71,12.19 C125.2 359.92,12.19 359.41,12.7 C127.+
  pour Route2 (isolate 0.305): 335.28,77.47 335.28,80.01 334.01,81.28 313.69,81.28 312.42,80.01 314.96,77.47 314.96,0 370.84,0 370.84,111.76 356.87,111.76 356.87,74.93 355.6,73.66 347.98,73.66 347.98,45.72 345.44,43.18 323.85,43.18 320.04,46.99 320.04,68.58 323.85,72.39 330.2,72.39
+3V3A  (via drill 0.38)
  Top 0.254: U$7.51 256.14,49.3 v256.54,48.9 | U$7.45 258.69,51.05 v258.44,50.8 | U$7.5 259.35,40.27 v259.72,40.64 | U$7.62 256.14,42.15 v256.54,42.55 | U$12.5 v265.11,13.01 v265.11,13.02 | U$12.10 263.81,7.02 263.21,7.62 v262.25,7.62 | v257.49,13.02 257.49,11.7 U$13.5 | U$13.10 256.19,7.02 255.59,7.62 v254.63,7.62 | U$11.5 v249.23,13.01 v249.24,13.02 | U$11.10 247.93,7.02 247.33,7.62 v246.38,7.62 | IC3.8 234.31,80.64 v233.05,79.38 | C188.1 v250.51,38.42 250.51,37.66 R164.2 | IC6.8 258.57,77.47 C149.2 v258.44,76.2 | C133.1 223.65,41.91 IC25.8 v220.34,41.91
  Top 0.406: L7.1 v292.74,88.27 292.42,87.95 C190.+
  Bottom 0.254: C146.1 256.41,49.02 v256.54,48.9 | C145.1 258.64,50.99 v258.44,50.8 | C143.1 259.52,40.45 v259.72,40.64 | C144.1 256.41,42.42 v256.54,42.55 | 265.11,10.6 v265.11,13.02 | C120.1 265.11,10.6 | C121.+ 265.56,10.16 265.11,10.6 | C122.1 256.67,9.65 257.49,10.48 | 257.49,10.48 v257.49,13.02 | C123.+ 257.81,10.16 257.49,10.48 | 249.24,10.6 v249.24,13.02 | C98.1 249.24,10.6 | C116.+ 249.68,10.16 249.24,10.6 | v233.05,79.38 233.05,80.52 C103.2
  pour Route2: 198.12,111.76 297.18,111.76 297.18,74.93 262.89,74.93 262.89,26.67 270.51,19.05 270.51,0 198.12,0
+3V3C  (via drill 0.38, 0.6)
  Top 0.152: v284.48,56.83 282.26,59.05 281.31,59.05 280.04,60.33 280.04,67.31 279.4,67.94 v278.76,67.94 | Y3.4 v268.61,38.42 | R71.1 v282.57,12.7 | R32.2 v303.53,8.89 | v281.31,73.03 282.57,74.3 285.75,74.3 288.29,76.83 288.29,81.6 288.74,82.04 R47.2 R77.2 | v287.02,52.39 v299.72,52.39 | U$11.11 248.58,5.1 248.6,5.08 248.6,1.27 | U$13.11 256.84,5.1 256.86,5.08 256.86,1.27 | U$12.11 264.45,5.1 264.48,5.08 264.48,1.27
  Top 0.254: U9.49 295.86,27.36 v296.55,26.67 | U9.43 300.66,26.68 v300.67,26.67 | U9.9 298.26,15.43 v298.77,14.92 | U9.14 302.26,15.56 v302.89,14.92 | U9.27 312.66,15.63 v313.37,14.92 | U9.1 291.86,16.11 292.42,15.56 293.69,15.56 | v293.69,14.92 293.69,15.56 | U9.3 293.46,16.29 C179.2 293.69,15.56 | v278.76,67.94 Y2.4 | v311.15,74.3 3V3C.TP | U$7.17 266.18,40.84 v265.75,41.27 | U$7.32 267.45,50.59 267.02,50.16 v264.8,50.16 | R166.1 v268.61,55.88 | U13.16 v221.62,4.45 221.62,1.27 | 225.43,4.45 U12.10 225.43,1.27 | U12.16 v233.05,4.45 233.05,1.27 | 236.86,4.45 U11.10 236.86,1.27 | U11.16 v244.47,4.45 244.47,1.27 | 214,1.27 221.62,1.27 | 221.62,1.27 225.43,1.27 | 225.43,1.27 233.05,1.27 | 233.05,1.27 236.86,1.27 | 236.86,1.27 244.47,1.27 | 244.47,1.27 248.6,1.27 256.86,1.27 264.48,1.27 v272.42,1.27 | 214,1.27 U13.10 | IC1.14 v231.14,29.84 229.24,27.94 227.97,27.94 223.52,32.38 213.36,32.38 210.19,29.21 210.19,27.94 | IC2.14 v214.63,29.84 212.72,27.94 210.19,27.94 | 210.19,27.94 210.19,5.08 214,1.27
  Top 0.406: v309.25,77.47 R42.1 307.34,77.6 307.34,79.38 306.07,80.64 306.07,85.72 303.53,88.27 L7.2
  Bottom 0.152: R8.2 v284.48,56.83 287.02,54.29 v287.02,52.39 | v268.61,38.42 269.24,39.05 R75.2 271.91,37.53 C97.1 | R79.2 R78.2 v299.72,52.39 | R72.2 R73.2 286.58,30.35 v287.02,30.8
  Bottom 0.254: C182.2 v296.55,26.67 | C181.2 v300.67,26.67 | C183.2 298.13,15.56 v298.77,14.92 | C180.2 302.26,15.56 v302.89,14.92 | C184.2 312.74,15.56 v313.37,14.92 | v293.69,14.92 C179.2 C42.2 | v278.76,67.94 278.76,65.41 278.13,64.77 R48.2 C96.1 | v265.75,41.27 264.92,41.27 C189.1 | C142.1 v264.8,50.16 | C119.1 221.11,4.95 v221.62,4.45 | C118.1 232.54,4.95 v233.05,4.45 | C117.1 243.97,4.95 v244.47,4.45 | v231.14,29.84 231.14,30.61 C129.1 | v214.63,29.84 214.63,30.61 C130.1
  pour Route2: 309.88,78.74 311.15,78.74 313.69,76.2 313.69,0 271.78,0 271.78,20.32 264.16,27.94 264.16,73.66 275.59,73.66 275.59,33.02 276.86,31.75 307.34,31.75 308.61,33.02 308.61,63.5 307.34,64.77 276.86,64.77 276.86,73.66 304.8,73.66
+5V  (via drill 0.38, 0.6, 0.7)  (1 unrouted)
  Top 0.254: U2.20 319.7,89.88 v320.04,89.53 | R19.2 308.74,95.38 v309.88,96.52 311.02,95.38 R20.2 | U4.3 313.69,92.08 v314.32,91.44 313.69,90.81 U4.2 | C63.2 504.19,30.48 506.73,33.02 506.73,36.83 | C62.2 524.51,30.48 523.56,31.43 521.65,31.43 520.7,32.38 v520.7,36.83 | C61.2 520.07,1.91 522.61,4.45 522.61,6.99 521.97,7.62 520.7,7.62 520.07,6.99 U$3.P$5 | C60.2 551.18,1.91 554.36,5.08 554.36,6.99 553.72,7.62 551.82,7.62 | 5V.TP v313.06,85.09
  Top 0.406: C2.2 v298.77,82.55 | U8.3 300.28,82.47 C2.2 | C2.2 C3.+
  Top 0.61: U7.3 332.33,90.58 331.47,91.44 C47.2 | C47.2 C48.+ | 349.25,82.55 U6.6 | 349.25,82.55 v353.06,82.55 358.83,88.32 L1.2 360.74,88.27 361.31,88.27 365.12,84.45 365.12,71.12 369.57,66.67 369.57,16.51 P1.26 | 349.25,82.55 348.62,81.92 348.62,80.14 C46.1 | C47.2 v331.47,97.79 | v546.74,24.77 551.82,19.68 551.82,7.62 U$2.P$5 | U$5.P$5 504.19,35.56 505.46,36.83 506.73,36.83 v520.7,36.83 | v548,107.95 R68.2
  Bottom 0.254: v320.04,89.53 320.55,89.03 C53.2 320.55,87.5 320.04,87 C54.+
  Bottom 0.406: C128.+ 359.41,6.35 359.92,5.84 C126.2 362.71,5.84 365.76,8.89 365.76,12.7 P1.26
  Bottom 0.61: 567.69,13.34 P2.26 | 567.69,13.34 567.69,7.62 561.34,1.27 551.82,1.27 | 551.82,1.27 522.61,1.27 520.07,3.81 U$3.P$5 | 551.82,1.27 U$2.P$5 | v546.74,24.77 541.02,30.48 537.21,30.48 535.94,31.75 U$4.P$5 535.94,35.56 534.67,36.83 v520.7,36.83 | 567.69,13.34 567.69,96.52 556.26,107.95 v548,107.95
  pour Route2 (isolate 0.305): 354.33,74.93 344.17,74.93 336.55,82.55 311.15,82.55 303.53,74.93 298.45,74.93 298.45,111.76 355.6,111.76 355.6,76.2
+5VA
  Top 0.254: U5.5 537.22,82.24 537.53,82.55 | C68.2 538.16,83.19 537.53,82.55 | U5.6 537.19,82.89 537.53,82.55 | R51.2 500.25,94.49 500.7,94.93 500.7,96.84 502.92,99.06 508,99.06 512.44,103.5 518.8,103.5 | 518.8,103.5 528.95,103.5 | R54.2 510.41,94.49 510.86,94.93 510.86,96.84 513.08,99.06 517.52,99.06 518.8,100.33 518.8,103.5 | R57.2 520.57,94.49 521.02,94.93 521.02,96.84 523.24,99.06 527.68,99.06 528.95,100.33 528.95,103.5 | R60.2 530.73,94.49 531.18,94.93 531.18,96.84 533.4,99.06 539.12,99.06 | 528.95,103.5 539.12,103.5 | R67.1 530.86,86.36 529.59,87.63 529.59,88.9 530.86,90.17 539.12,90.17
  Top 0.61: C68.2 538.35,83.69 539.12,84.45 C69.+ 539.12,90.17 539.12,99.06 539.12,103.5 543.56,107.95 R68.1
A-A2  (via drill 0.38)
  Top 0.152: v360.68,51.44 360.05,50.8 348.93,50.8 347.56,52.17 U1.114
  Bottom 0.152: v360.68,51.44 360.89,51.22 U3.23
A-A3  (via drill 0.38)
  Top 0.152: U1.112 346.66,51.17 347.98,49.85 360.05,49.85 v360.68,50.48
  Bottom 0.152: v360.68,50.48 362.26,50.48 U3.24
A-A4  (via drill 0.38)
  Top 0.152: U1.110 345.44,50.17 346.71,48.9 360.05,48.9 v360.68,49.53
  Bottom 0.152: v360.68,49.53 360.77,49.62 U3.25
A-A5  (via drill 0.38)
  Top 0.152: U1.107 342.26,46.99 342.58,46.67 343.22,46.67 345.12,48.58 v360.68,48.58
  Bottom 0.152: v360.68,48.58 360.92,48.82 U3.26
A-A6  (via drill 0.38)
  Top 0.152: U1.105 341.26,47.04 341.95,46.35 343.53,46.35 345.44,48.26 349.25,48.26 v349.57,47.94
  Bottom 0.152: U3.29 350.44,48.82 v349.57,47.94
A-A7  (via drill 0.38)
  Top 0.152: v348.3,47.62 347.98,47.94 345.76,47.94 343.85,46.04 341,46.04 340.26,46.77 U1.103
  Bottom 0.152: U3.30 350.29,49.62 v348.3,47.62
A-A8  (via drill 0.38)
  Top 0.152: v347.03,47.31 346.71,47.62 346.08,47.62 344.17,45.72 340.36,45.72 339.26,46.82 U1.101
  Bottom 0.152: U3.31 350.14,50.42 v347.03,47.31
A-A9  (via drill 0.38)
  Top 0.152: v346.08,46.67 345.76,46.67 344.49,45.4 339.73,45.4 338.26,46.87 U1.99
  Bottom 0.152: U3.32 349.99,51.22 346.08,47.31 v346.08,46.67
A-A10  (via drill 0.38)
  Top 0.152: v345.44,45.4 345.12,45.09 339.09,45.09 337.26,46.91 U1.97
  Bottom 0.152: U3.33 350.15,52.02 345.44,47.31 v345.44,45.4
A-A11  (via drill 0.38)
  Top 0.152: U1.95 336.26,46.96 338.46,44.77 344.17,44.77 v344.49,44.45
  Bottom 0.152: U3.34 350.32,52.82 344.49,46.99 v344.49,44.45
A-A13  (via drill 0.38)
  Top 0.152: v353.06,46.67 347.66,46.67 344.81,43.81 338.46,43.81 335.91,46.35 333.69,46.35 333.26,46.79 U1.89
  Bottom 0.152: U3.35 352.78,53.62 354.01,52.39 354.01,47.62 v353.06,46.67
A-A14  (via drill 0.38)
  Top 0.152: U1.87 332.26,46.99 334.96,44.29 v336.87,44.29 | v339.73,42.55 347.35,42.55 350.2,45.4 354.33,45.4 v355.12,46.2
  Bottom 0.152: v336.87,44.29 337.98,44.29 v339.73,42.55 | v355.12,46.2 355.12,51.75 352.46,54.42 U3.36
A-A16  (via drill 0.38)
  Top 0.152: v358.46,46.99 354.97,46.99 353.69,45.72 349.25,45.72 346.71,43.18 325.75,43.18 323.22,45.72 323.22,47.94 325.75,50.48 325.75,52.7 325.29,53.17 U1.65
  Bottom 0.152: U3.20 361.28,53.62 359.73,52.07 359.73,48.26 v358.46,46.99
A-A17  (via drill 0.38)
  Top 0.152: v360.05,47.62 354.97,47.62 353.38,46.04 348.3,46.04 345.76,43.5 326.07,43.5 323.85,45.72 323.85,47.94 326.07,50.16 326.07,53.66 325.56,54.17 U1.63
  Bottom 0.152: U3.21 361.11,52.82 360.05,51.75 v360.05,47.62
A-D0  (via drill 0.38)
  Top 0.152: v360.68,67.94 354.97,73.66 326.71,73.66 323.85,70.8 323.85,70.17 324.49,69.53 324.49,66.99 324.16,66.67 U1.38
  Bottom 0.152: U3.2 360.92,68.02 v360.68,67.94
A-D1  (via drill 0.38)
  Top 0.152: U1.35 325.76,71.12 327.98,73.34 354.33,73.34 v360.68,66.99
  Bottom 0.152: U3.4 361.25,66.42 v360.68,66.99
A-D2  (via drill 0.38)
  Top 0.152: U1.33 326.76,70.22 329.56,73.03 353.69,73.03 v360.68,66.04
  Bottom 0.152: U3.5 361.1,65.62 v360.68,66.04
A-D3  (via drill 0.38)
  Top 0.152: U1.31 327.76,70.58 329.88,72.71 352.74,72.71 v360.68,64.77
  Bottom 0.152: U3.7 361.43,64.02 v360.68,64.77
A-D4  (via drill 0.38)
  Top 0.152: U1.26 330.26,70.55 332.11,72.39 352.11,72.39 v360.68,63.82
  Bottom 0.152: U3.8 361.28,63.22 v360.68,63.82
A-D5  (via drill 0.38)
  Top 0.152: U1.24 331.26,70.91 332.42,72.07 351.47,72.07 v360.68,62.87
  Bottom 0.152: U3.10 361.29,61.62 360.68,62.23 v360.68,62.87
A-D6  (via drill 0.38)
  Top 0.152: U1.12 337.26,70.56 338.46,71.75 350.84,71.75 360.68,61.91 v360.68,61.28
  Bottom 0.152: U3.11 361.14,60.82 v360.68,61.28
A-D7  (via drill 0.38)
  Top 0.152: U1.10 338.26,70.92 338.77,71.44 350.52,71.44 359.73,62.23 v359.73,60.01
  Bottom 0.152: U3.13 360.51,59.22 v359.73,60.01
A-D8  (via drill 0.38)
  Top 0.152: v354.97,60.96 354.97,66.36 350.2,71.12 342.26,71.12 341.26,70.11 U1.4
  Bottom 0.152: U3.42 352.59,59.22 353.06,59.69 353.69,59.69 v354.97,60.96
A-D9  (via drill 0.38)
  Top 0.152: U1.2 342.26,69.84 343.22,70.8 349.88,70.8 354.33,66.36 354.33,61.28 v354.01,60.96
  Bottom 0.152: v354.01,60.96 353.87,60.82 U3.44
A-D10  (via drill 0.38)
  Top 0.152: U1.1 342.76,69.71 343.53,70.48 349.57,70.48 354.01,66.04 354.01,62.55 v353.06,61.59
  Bottom 0.152: v353.06,61.59 351.44,61.59 U3.45
A-D11  (via drill 0.38)
  Top 0.152: 347.66,66.99 v347.98,66.67 347.49,67.17 U1.144
  Bottom 0.152: U3.47 349.88,63.18 349.29,62.59 348.58,62.59 347.98,63.18 v347.98,66.67
A-D12  (via drill 0.38)
  Top 0.152: v353.06,64.14 353.69,64.77 353.69,65.72 353.38,66.04 345.76,66.04 345.63,66.17 U1.142
  Bottom 0.152: U3.48 352.94,64.02 v353.06,64.14
A-D13  (via drill 0.38)
  Top 0.152: U1.140 345.52,65.17 345.76,65.41 v353.06,65.41
  Bottom 0.152: v353.06,65.41 352.85,65.62 U3.50
A-D14  (via drill 0.38)
  Top 0.152: v348.93,64.77 348.62,65.09 347.03,65.09 345.61,63.67 U1.137
  Bottom 0.152: U3.51 350.58,66.42 v348.93,64.77
A-D15  (via drill 0.38)
  Top 0.152: U1.135 348.42,62.67 v348.93,63.18
  Bottom 0.152: U3.53 350.6,68.02 348.3,65.72 348.3,63.82 v348.93,63.18
A-RESET  (via drill 0.38)
  Top 0.152: U1.23 331.76,67.34 v331.79,67.31 | v337.5,74.3 338.46,74.3 339.09,74.93 340.36,74.93 341,74.3 355.28,74.3 v357.5,72.07 | v357.5,44.45 346.71,33.66 332.11,33.66 v330.2,31.75 | U$1.2 326.42,7.78 326.42,10 C1.1 | R1.1 323.09,7.75 v322.58,8.26 319.4,8.26 JP1.6
  Top 0.406: R1.1 326.42,7.78
  Bottom 0.152: v331.79,67.31 332.42,67.94 334.64,67.94 337.5,70.8 v337.5,74.3 | v357.5,44.45 v357.5,72.07 | v330.2,31.75 329.56,31.11 329.56,17.78 322.58,10.79 v322.58,8.26
A-SDA10  (via drill 0.38)
  Top 0.152: U1.136 347.97,63.17 348.62,63.82 349.88,63.82 358.77,54.93 v363.86,54.93
  Bottom 0.152: v363.86,54.93 363.86,52.7 363.17,52.02 U3.22
A-TCK  (via drill 0.38)
  Top 0.152: U1.129 342.6,59.67 341.63,60.64 341.63,66.67 344.17,69.22 v345.12,69.22 | v354.97,43.18 346.08,34.29 331.47,34.29 v329.25,32.07
  Bottom 0.152: v345.12,69.22 346.39,70.48 354.65,70.48 356.87,68.26 356.87,43.81 356.24,43.18 v354.97,43.18 | v329.25,32.07 328.93,31.75 328.93,18.41 318.77,8.26 318.77,3.17 318.13,2.54 313.69,2.54 JP1.1
A-TDI  (via drill 0.38)
  Top 0.152: U1.131 342.87,60.67 342.26,61.28 342.26,66.04 344.17,67.94 v346.39,67.94 | v353.06,43.81 344.81,35.56 329.56,35.56 v327.34,33.34 | v318.77,10.79 317.5,10.79 313.69,6.99 313.69,3.17 314.32,2.54 321.31,2.54 JP1.9
  Bottom 0.152: v346.39,67.94 348.3,69.85 354.01,69.85 356.24,67.63 356.24,45.72 354.33,43.81 v353.06,43.81 | v327.34,33.34 327.34,32.07 327.66,31.75 327.66,19.68 v318.77,10.79
A-TDO  (via drill 0.38)
  Top 0.152: U1.130 342.74,60.17 341.95,60.96 341.95,66.36 344.17,68.58 v345.76,68.58 | v355.6,43.81 354.33,43.81 345.44,34.92 330.84,34.92 v328.3,32.38
  Bottom 0.152: v345.76,68.58 347.35,70.17 354.33,70.17 356.55,67.94 356.55,44.77 v355.6,43.81 | v328.3,32.38 328.3,19.05 316.23,6.99 316.23,5.08 JP1.3
A-TMS  (via drill 0.38)
  Top 0.152: U1.128 345.56,59.17 346.08,59.69 v346.08,61.91 | v352.43,44.45 344.17,36.2 328.3,36.2 v326.39,34.29 | v317.5,9.53 316.23,8.26 316.23,5.08 JP1.5
  Bottom 0.152: v346.08,61.91 346.08,66.04 349.57,69.53 353.69,69.53 355.92,67.31 355.92,46.04 354.33,44.45 v352.43,44.45 | v326.39,34.29 326.39,31.75 327.02,31.11 327.02,20.32 317.5,10.79 v317.5,9.53
ABE0_  (via drill 0.38)
  Top 0.152: DSP1.P$151 303.69,46.51 300.36,43.18 300.36,39.69 303.85,36.2 v303.85,34.61 | v303.85,26.67 303.85,22.86 303.21,22.23 303.21,18.73 303.06,18.58 U9.15
  Bottom 0.152: v303.85,26.67 v303.85,34.61
ABE1_  (via drill 0.38)
  Top 0.152: DSP1.P$150 303.82,46.01 300.67,42.86 300.67,40.01 v304.48,36.2 | U9.39 303.86,30.15 v304.48,30.8
  Bottom 0.152: v304.48,30.8 v304.48,36.2
AD1939_RESET  (via drill 0.38)
  Top 0.152: U$7.14 265.19,39.92 264.8,40.32 v262.89,40.32 | DSP1.P$50 v277.5,56.51 v277.5,56.52
  Bottom 0.152: R165.1 v262.89,40.32 262.57,40.32 261.94,40.96 261.94,43.5 263.52,45.09 263.52,49.85 264.48,50.8 267.02,50.8 272.73,56.52 v277.5,56.52
AGND  (via drill 0.38)  (2 unrouted)
  Top 0.203: R53.2 v505.46,93.34 | R62.2 v535.94,93.34 | R59.2 v525.78,93.34
  Top 0.254: C69.- 541.02,85.72 540.38,85.09 540.38,84.45 539.88,83.95 C68.1 | C68.1 539.75,83.19 | U5.4 535.31,81.59 534.99,81.92 | 535.36,84.19 U5.8 534.93,84.19 | U5.13 531.5,81.59 531.81,81.28 | 531.81,81.28 531.81,80.01 531.44,79.64 U5.16 | 534.99,81.92 v533.4,81.92 532.76,81.28 531.81,81.28 | v542.92,109.86 R69.1 | 534.93,84.19 v534.04,85.09 534.04,86.36 | U10.2 534.36,86.68 534.04,86.36 | C72.1 533.91,86.23 534.04,86.36 | 534.99,81.92 534.99,84.14 534.93,84.19 | C68.1 v541.02,83.19 | C64.2 R53.2 | C65.2 R56.2 | C66.2 R59.2 | C67.2 R62.2 | U$7.1 256.75,40.21 257.18,40.64 v257.81,40.64 258.69,39.76 U$7.4 | U$7.44 259.35,51.17 v259.72,50.8 | U$7.48 256.75,51.23 v257.18,50.8 258.05,51.67 U$7.46 | C100.- 250.82,50.8 251.33,50.29 C99.1 v252.09,51.44 | C102.- 255.27,56.52 255.78,56.01 C101.1 v254.63,55.24 | U$12.4 265.75,9.21 v265.43,8.89 | U$12.16 267.7,6.72 v268.61,7.62 | U$13.16 260.09,6.72 v260.99,7.62 | U$13.4 258.13,9.21 v257.81,8.89 | U$11.4 249.88,9.21 v249.56,8.89 | U$11.16 251.83,6.72 v252.73,7.62 | v217.81,4.45 U13.13 217.81,7.62 217.17,8.26 214,8.26 212.72,9.53 U13.8 | U12.8 224.16,9.53 225.43,8.26 228.6,8.26 229.24,7.62 U12.13 v229.24,4.45 | U11.8 235.59,9.53 236.86,8.26 240.03,8.26 240.67,7.62 U11.13 v240.67,4.45 | 227.14,75.56 C107.1 227.46,75.88 227.97,75.88 228.92,76.83 IC3.4 v231.78,76.83 | 237.49,75.88 C113.1 236.92,75.75 R84.2 v233.68,73.66 | R81.2 v223.52,73.66 | C105.2 v231.14,73.66 | C111.2 v241.3,73.66 | C148.1 268.48,81.28 IC6.4 IC6.3 264.16,80.01 v263.52,79.38 | IC6.5 261.62,81.28 v263.52,79.38 | C149.1 258.44,78.74 259.08,78.11 262.25,78.11 v263.52,79.38 | IC1.7 v238.76,24.13 | IC2.7 v222.25,24.13
  Top 0.254: IC25.3 IC25.4 v219.07,38.1 IC25.5 | C133.2 v224.16,45.09
  Top 0.406: L8.1 v292.74,85.09 292.42,85.41 C190.-
  Bottom 0.254: C143.2 258,40.45 v257.81,40.64 | C144.2 256.41,43.94 v256.54,43.81 | C146.2 256.41,47.5 v256.54,47.62 | C145.2 260.16,51.24 v259.72,50.8 | C121.- v265.43,8.89 264.8,8.26 264.29,8.26 C120.2 | C123.- v257.81,8.89 257.05,8.13 C122.2 | C98.2 248.79,8.13 v249.56,8.89 C116.- | v217.81,4.45 217.81,4.57 C119.2 | v229.24,4.45 229.24,4.57 C118.2 | v240.67,4.45 240.67,4.57 C117.2 | C108.1 229.43,84.52 R89.2 | C108.1 231.33,80.64 C103.1 231.78,80.52 v231.78,76.83 | R97.2 234.82,84.26 235.27,83.82 235.27,82.68 C114.1 C110.1 237.68,83.06 v238.44,83.82 | C152.2 264.16,78.74 v263.52,79.38 262.89,78.74 C153.1 | C108.1 C104.1 | C129.2 v234.95,31.75 | C130.2 v218.44,31.75
  pour Route3 (isolate 0.305): 298.45,111.76 298.45,88.9 289.56,80.01 279.4,80.01 262.89,63.5 262.89,26.67 270.51,19.05 270.51,0 198.12,0 198.12,111.76
  pour Bottom: 544.83,111.76 544.83,80.01 542.29,77.47 396.24,77.47 396.24,111.76
B-A1  (via drill 0.38)
  Top 0.152: DSP1.P$149 308.82,45.51 v311.47,42.86 | v311.47,25.08 311.47,21.27 309.46,19.27 U9.23
  Bottom 0.152: v311.47,25.08 v311.47,42.86
B-A2  (via drill 0.38)
  Top 0.152: DSP1.P$148 308.05,45.01 v312.1,40.96 | v312.1,23.5 312.1,20.95 310.26,19.11 U9.24
  Bottom 0.152: v312.1,23.5 v312.1,40.96
B-A3  (via drill 0.38)
  Top 0.152: DSP1.P$147 307.28,44.51 v312.74,39.05 | v312.74,21.91 312.74,20.64 311.06,18.96 U9.25
  Bottom 0.152: v312.74,21.91 v312.74,39.05
B-A4  (via drill 0.38)